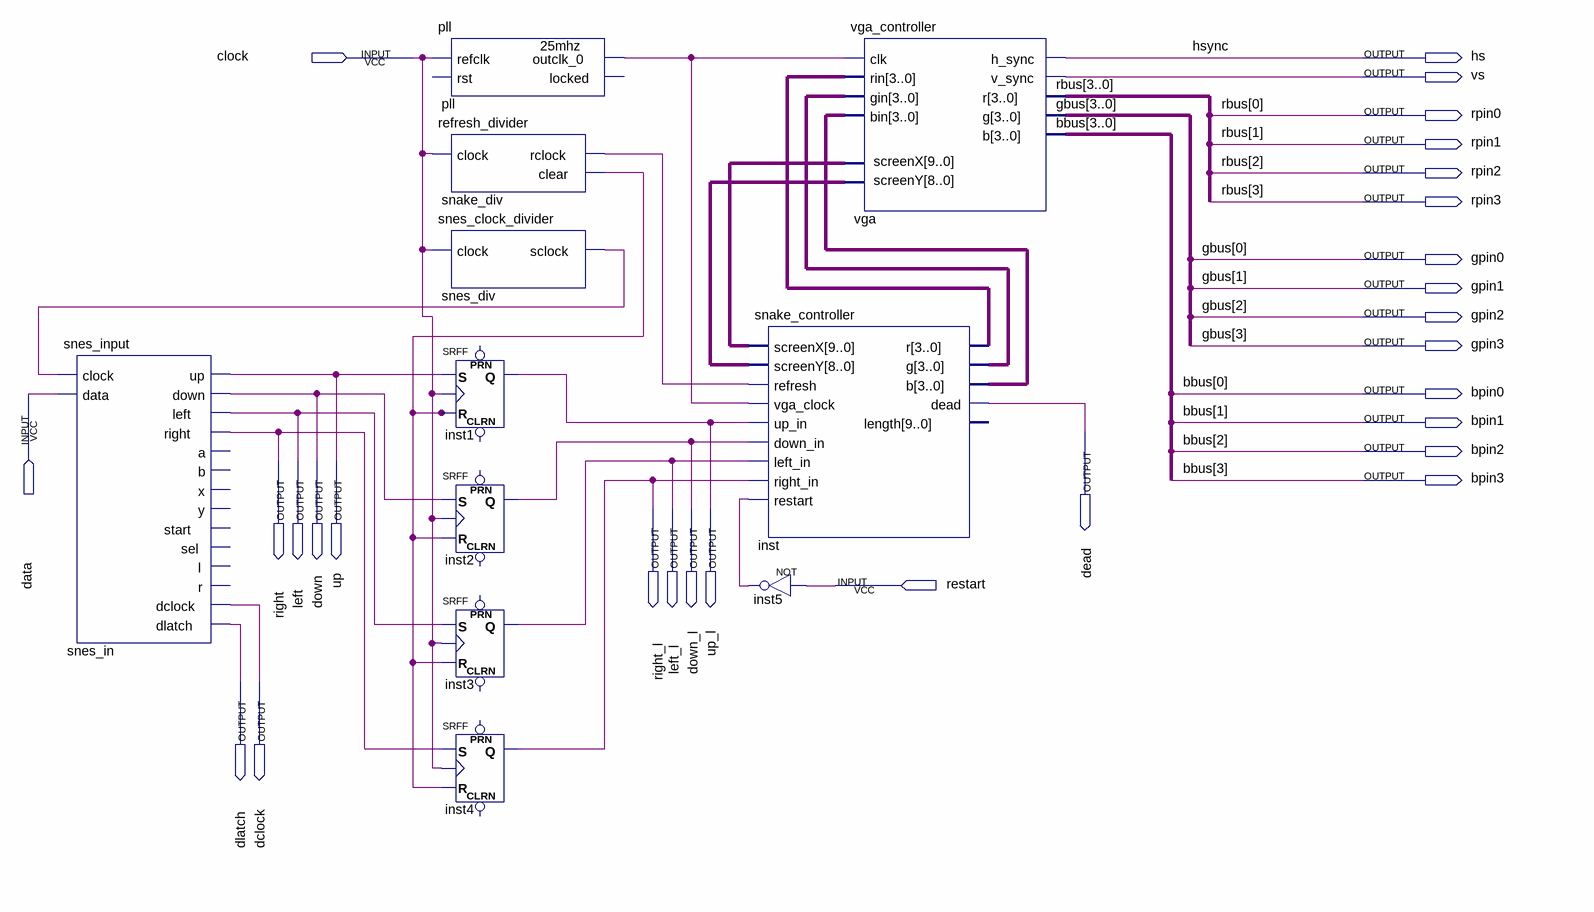
[diagram p0: schematic sheet]
// Quartus schematic snake.bdf as structural Verilog: 11 symbols, 28 pins
module snake (
  input  clock,
  input  data,
  input  restart,
  output hs,
  output vs,
  output rpin0,
  output rpin1,
  output rpin2,
  output rpin3,
  output gpin0,
  output gpin1,
  output gpin2,
  output gpin3,
  output bpin0,
  output bpin1,
  output dead,
  output bpin2,
  output right,
  output left,
  output down,
  output up,
  output bpin3,
  output right_l,
  output left_l,
  output down_l,
  output up_l,
  output dlatch,
  output dclock
);

  wire \25mhz , inst5_out, snake_div_clear, snake_div_rclock, snes_div_sclock;
  wire [3:0] inst_b, inst_g, inst_r;
  wire [8:0] vga_screeny;
  wire [9:0] vga_screenx;

  snes_input snes_in (
    .clock(snes_div_sclock), .data(data), .up(up), .down(down), .left(left), .right(right), .dclock(dclock),
    .dlatch(dlatch));  // open: a, b, x, y, start, sel, l, r
  pll pll (.refclk(clock), .outclk_0(\25mhz ));  // open: rst, locked
  refresh_divider snake_div (.clock(clock), .rclock(snake_div_rclock), .clear(snake_div_clear));
  snes_clock_divider snes_div (.clock(clock), .sclock(snes_div_sclock));
  SRFF inst1 (.S(up), .R(snake_div_clear), .CLK(clock), .Q(up_l));  // open: PRN, CLRN
  SRFF inst2 (.S(down), .R(snake_div_clear), .CLK(clock), .Q(down_l));  // open: PRN, CLRN
  SRFF inst3 (.S(left), .R(snake_div_clear), .CLK(clock), .Q(left_l));  // open: PRN, CLRN
  SRFF inst4 (.S(right), .R(snake_div_clear), .CLK(clock), .Q(right_l));  // open: PRN, CLRN
  snake_controller inst (
    .screenX(vga_screenx), .screenY(vga_screeny), .refresh(snake_div_rclock), .vga_clock(\25mhz ),
    .up_in(up_l), .down_in(down_l), .left_in(left_l), .right_in(right_l), .restart(inst5_out), .r(inst_r),
    .g(inst_g), .b(inst_b), .dead(dead));  // open: length
  not inst5 (inst5_out, restart);
  vga_controller vga (
    .clk(\25mhz ), .rin(inst_r), .gin(inst_g), .bin(inst_b), .h_sync(hs), .v_sync(vs),
    .r({rpin3, rpin2, rpin1, rpin0}), .g({gpin3, gpin2, gpin1, gpin0}), .b({bpin3, bpin2, bpin1, bpin0}),
    .screenX(vga_screenx), .screenY(vga_screeny));

  // Other names for the same wires on the sheet: bbus[3:0] = {bpin3, bpin2, bpin1, bpin0};
  //   gbus[3:0] = {gpin3, gpin2, gpin1, gpin0}; hsync = hs; rbus[3:0] = {rpin3, rpin2, rpin1, rpin0}
endmodule
